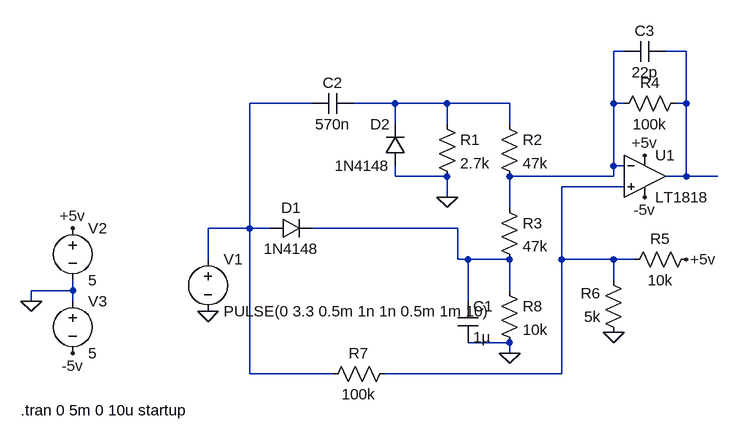
[diagram p0: schematic Saegezahnaufbau.asc]
Saegezahnaufbau.asc, the LTspice schematic file:
Version 4.1
SHEET 1 880 680
WIRE 336 -304 320 -304
WIRE 432 -304 400 -304
WIRE -144 -224 -240 -224
WIRE -16 -224 -80 -224
WIRE 64 -224 -16 -224
WIRE 160 -224 64 -224
WIRE 320 -224 320 -304
WIRE 336 -224 320 -224
WIRE 432 -224 432 -304
WIRE 432 -224 416 -224
WIRE -16 -192 -16 -224
WIRE 64 -192 64 -224
WIRE 160 -192 160 -224
WIRE 320 -128 320 -224
WIRE 336 -128 320 -128
WIRE -16 -112 -16 -128
WIRE 64 -112 -16 -112
WIRE 320 -112 320 -128
WIRE 320 -112 160 -112
WIRE 432 -112 432 -224
WIRE 432 -112 400 -112
WIRE 480 -112 432 -112
WIRE 336 -96 240 -96
WIRE 64 -80 64 -112
WIRE 160 -64 160 -112
WIRE -240 -32 -240 -224
WIRE -240 -32 -304 -32
WIRE -208 -32 -240 -32
WIRE 80 -32 -144 -32
WIRE -304 16 -304 -32
WIRE 80 16 80 -32
WIRE 96 16 80 16
WIRE 160 16 96 16
WIRE 240 16 240 -96
WIRE 320 16 240 16
WIRE 352 16 320 16
WIRE 320 48 320 16
WIRE -512 64 -512 48
WIRE -512 64 -576 64
WIRE 160 64 160 16
WIRE -576 80 -576 64
WIRE -512 80 -512 64
WIRE 96 80 96 16
WIRE 160 144 96 144
WIRE 160 160 160 144
WIRE -240 192 -240 -32
WIRE -112 192 -240 192
WIRE 240 192 240 16
WIRE 240 192 -32 192
FLAG 320 128 0
FLAG 64 -80 0
FLAG 160 160 0
FLAG 368 -144 +5v
FLAG 432 16 +5v
FLAG 368 -80 -5v
FLAG -304 96 0
FLAG -576 80 0
FLAG -512 -32 +5v
FLAG -512 160 -5v
SYMBOL diode -208 -16 R270
WINDOW 0 32 32 VTop 2
WINDOW 3 0 32 VBottom 2
SYMATTR InstName D1
SYMATTR Value 1N4148
SYMBOL diode 0 -128 R180
WINDOW 0 24 64 Left 2
WINDOW 3 24 0 Left 2
SYMATTR InstName D2
SYMATTR Value 1N4148
SYMBOL res 48 -208 R0
SYMATTR InstName R1
SYMATTR Value 2.7k
SYMBOL res 144 -208 R0
SYMATTR InstName R2
SYMATTR Value 47k
SYMBOL res 144 -80 R0
SYMATTR InstName R3
SYMATTR Value 47k
SYMBOL res 432 -240 R90
WINDOW 0 0 56 VBottom 2
WINDOW 3 32 56 VTop 2
SYMATTR InstName R4
SYMATTR Value 100k
SYMBOL res 448 0 R90
WINDOW 0 0 56 VBottom 2
WINDOW 3 32 56 VTop 2
SYMATTR InstName R5
SYMATTR Value 10k
SYMBOL res 336 144 R180
WINDOW 0 36 76 Left 2
WINDOW 3 36 40 Left 2
SYMATTR InstName R6
SYMATTR Value 5k
SYMBOL res -128 208 R270
WINDOW 0 32 56 VTop 2
WINDOW 3 0 56 VBottom 2
SYMATTR InstName R7
SYMATTR Value 100k
SYMBOL res 144 48 R0
SYMATTR InstName R8
SYMATTR Value 10k
SYMBOL cap 80 80 R0
SYMATTR InstName C1
SYMATTR Value 1µ
SYMBOL cap -80 -240 R90
WINDOW 0 0 32 VBottom 2
WINDOW 3 32 32 VTop 2
SYMATTR InstName C2
SYMATTR Value 570n
SYMBOL OpAmps\\LT1818 368 -112 R0
SYMATTR InstName U1
SYMBOL voltage -304 0 R0
WINDOW 123 0 0 Left 0
WINDOW 39 0 0 Left 0
SYMATTR InstName V1
SYMATTR Value PULSE(0 3.3 0.5m 1n 1n 0.5m 1m 10)
SYMBOL voltage -512 -48 R0
WINDOW 123 0 0 Left 0
WINDOW 39 0 0 Left 0
SYMATTR InstName V2
SYMATTR Value 5
SYMBOL voltage -512 64 R0
WINDOW 123 0 0 Left 0
WINDOW 39 0 0 Left 0
SYMATTR InstName V3
SYMATTR Value 5
SYMBOL cap 400 -320 R90
WINDOW 0 0 32 VBottom 2
WINDOW 3 32 32 VTop 2
SYMATTR InstName C3
SYMATTR Value 22p
TEXT -592 248 Left 2 !.tran 0 5m 0 10u startup

The netlist it stands for:
* Saegezahnaufbau.asc
D1 N003 N006 1N4148
D2 0 N004 1N4148
R1 N004 0 2.7k
R2 N004 N001 47k
R3 N001 N006 47k
R4 N002 N001 100k
R5 +5v N005 10k
R6 0 N005 5k
R7 N003 N005 100k
R8 N006 0 10k
C1 N006 0 1µ
C2 N004 N003 570n
X§U1 N005 N001 N002 +5v -5v LT1818  ; pins In+ In- OUT V+ V-
V1 N003 0 PULSE(0 3.3 0.5m 1n 1n 0.5m 1m 10)
V2 +5v 0 5
V3 0 -5v 5
C3 N002 N001 22p
.model D D
.lib standard.dio
.tran 0 5m 0 10u startup
.lib LTC2.lib
.backanno
.end